# Altium schematic sheet power-v1v8.SchDoc: Power 1.8V
size Letter; CheckedBy: J. Brinton; CompanyName: Signal Laboratories, Inc.; DrawnBy: J. Brinton; Engineer: J. Brinton; Address1: 3479 Edison Way; Address2: Menlo Park CA 94025; Address3: +1 (877) 778-8435; Address4: siglabs.com; Revision: 3; SheetNumber: 42; SheetTotal: 49
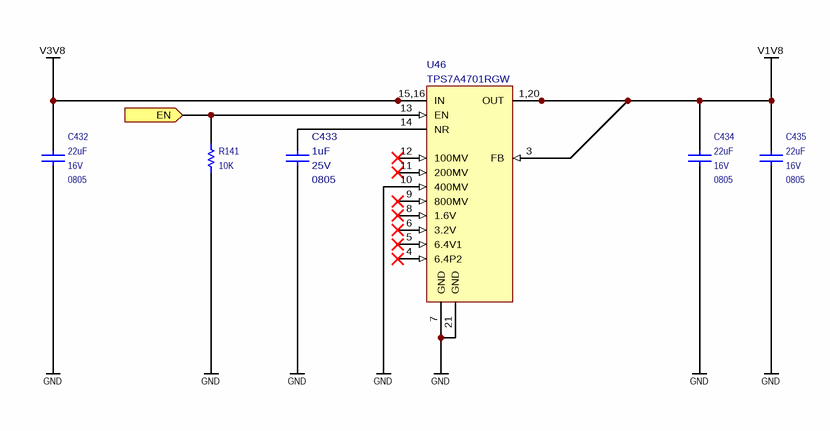
[diagram p0: power-v1v8.SchDoc]

## Parts
C432  value 22uF  Voltage: 16V  Package: 0805  [CAPC200X125X145L45N]  (hidden comment: CL21A226KOQNNNE)
C433  value 1uF  Package: 0805  Voltage: 25V  [CAPC200X125X145L45N]  (hidden comment: TMK212B7105KG)
C434  value 22uF  Voltage: 16V  Package: 0805  [CAPC200X125X145L45N]  (hidden comment: CL21A226KOQNNNE)
C435  value 22uF  Voltage: 16V  Package: 0805  [CAPC200X125X145L45N]  (hidden comment: CL21A226KOQNNNE)
R141  value 10K  [RESC1005X40N]  (hidden comment: ERJ-2RKF1002X)
U46  TPS7A4701RGW  [QFN65P500X500X100-21N]

## Ports
EN (in)

## Nets
GND: C432.1 C433.2 C434.1 C435.1 R141.2 U46.7(GND) U46.10(400MV) U46.21(GND)
V1V8: C434.2 C435.2 U46.1(OUT) U46.3(FB) U46.20(OUT)
V3V8: C432.2 U46.15(IN) U46.16(IN)
EN: R141.1 U46.13(EN) ; port EN
NetC433_1: C433.1 U46.14(NR)

Not connected (* = marked no-connect by the designer): U46 4(6.4P2)* 5(6.4V1)* 6(3.2V)* 8(1.6V)* 9(800MV)* 11(200MV)* 12(100MV)*

## Notes on the sheet
- Title
- Engineer
- Revision
- Drawn By
- Checked By
- Date
- Sheet
- of
- (in symbol TPS7A4701RGW_1) 15,16; 1,20

## Library data of the parts
C432 C434 C435 = CAP 0603: Ceramic Capacitor 22uF ±10% 16V X5R 0805; Manufacturer: Samsung; Tr: -55:85; Manufacturer P/N: CL21A226KOQNNNE; Tolerance: ±10%
C433 = TMK212B7105KG: Ceramic Capacitor 1uF ±10% 25V X7R 0805; Manufacturer: Taiyo Yuden; Manufacturer P/N: TMK212B7105KG; Tolerance: ±10%; Tr: *
R141 = RES 0402: Thick Film Resistor 10k ±1% 0.1W 50V 0402; Manufacturer: Panasonic; Tr: -55:155; Package: 0402; Manufacturer P/N: ERJ-2RKF1002X; Tolerance: ±1%
U46 = TPS7A4701RGW_1: Low-Dropout Linear Regulator 20-VQFN; Manufacturer: Texas Instruments; Manufacturer P/N: TPS7A4701RGW; Package: VQFN-20